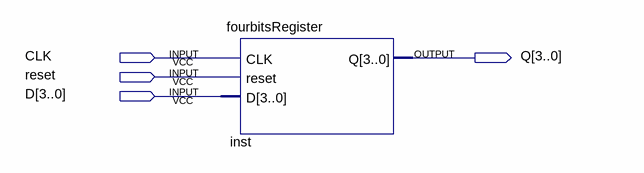
[diagram p0: schematic sheet]
// Quartus schematic testforbitsregister.bdf as structural Verilog: 1 symbols, 4 pins
module testforbitsregister (
  input  CLK,
  input  reset,
  input  [3:0] D,
  output [3:0] Q
);

  fourbitsRegister inst (.CLK(CLK), .reset(reset), .D(D), .Q(Q));
endmodule
